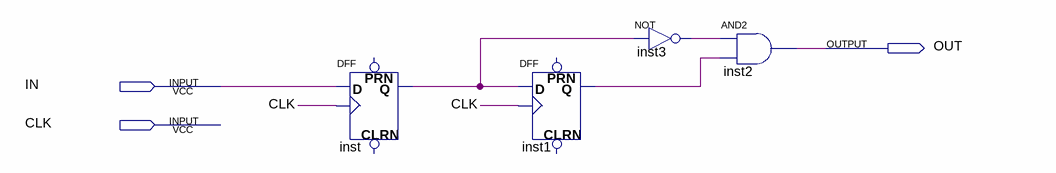
[diagram p0: schematic sheet]
// Quartus schematic FallingEdge.bdf as structural Verilog: 4 symbols, 3 pins
module FallingEdge (
  input  IN,
  input  CLK,
  output OUT
);

  wire inst1_q, inst3_out, inst_q;

  DFF inst (.CLK(CLK), .D(IN), .Q(inst_q));  // open: CLRN, PRN
  DFF inst1 (.CLK(CLK), .D(inst_q), .Q(inst1_q));  // open: CLRN, PRN
  not inst3 (inst3_out, inst_q);
  and inst2 (OUT, inst3_out, inst1_q);
endmodule
